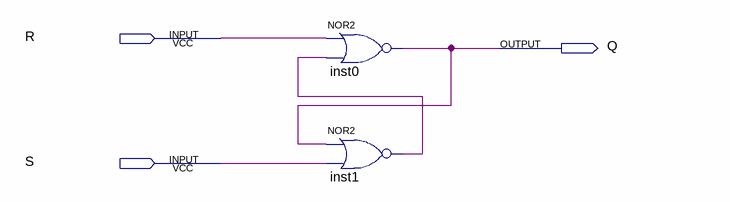
[diagram p0: schematic sheet]
// Quartus schematic Asyn-RS-Trigger.bdf as structural Verilog: 2 symbols, 3 pins
module \Asyn-RS-Trigger  (
  input  R,
  input  S,
  output Q
);

  wire inst1_out;

  nor inst0 (Q, R, inst1_out);
  nor inst1 (inst1_out, Q, S);
endmodule
